# Altium project Wirless_Speaker.PrjPcb
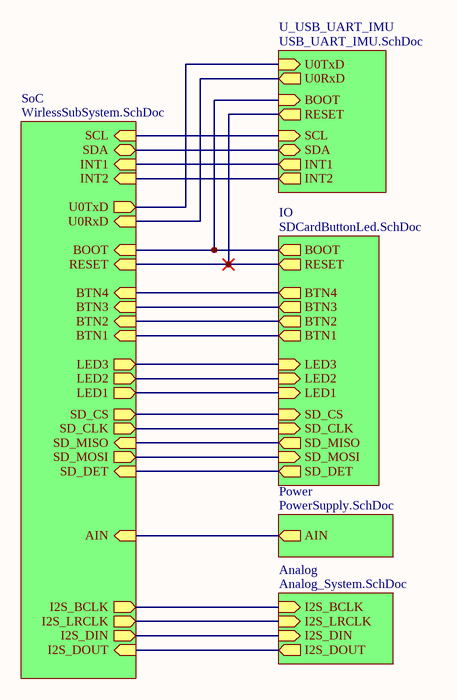
[diagram p0: WirlessSpeakerTop.SchDoc]
6 sheets, 94 parts. Net scope: hierarchical (ports join the sheet entries above them; power ports are global).
Board file: WirelessAudioSpeaker.PcbDoc
Sheets:
  WirlessSpeakerTop.SchDoc
    SoC = WirlessSubSystem.SchDoc
    IO = SDCardButtonLed.SchDoc
    Power = PowerSupply.SchDoc
    Analog = Analog_System.SchDoc
    U_USB_UART_IMU = USB_UART_IMU.SchDoc

## Sheet WirlessSpeakerTop.SchDoc
size A4; Date: 27.05.2014; Author: AOM1; DrawnBy: AOM1; Organization: BFH; Address1: Berner Fachhochschule; Address2: Technik und Informatik; Address3: Jlcoweg 1; Address4: 3400 Burgdorf; DocumentNumber: 1; Revision: 1.0; SheetNumber: 1; SheetTotal: 6; CurrentDate: 27.05.2014

### Sub-sheets
Analog = Analog_System.SchDoc: I2S_BCLK (in), I2S_LRCLK (in), I2S_DIN (in), I2S_DOUT (out)
IO = SDCardButtonLed.SchDoc: BOOT (out), RESET (out), BTN1 (out), BTN2 (out), BTN3 (out), BTN4 (out), LED1 (in), LED2 (in), LED3 (in), SD_CS (in), SD_CLK (in), SD_MISO (out), SD_MOSI (in), SD_DET (out)
Power = PowerSupply.SchDoc: AIN (out)
SoC = WirlessSubSystem.SchDoc: U0TxD (out), U0RxD (in), BOOT (in), RESET (in), SCL (in), SDA (bidir), INT1 (in), INT2 (in), BTN1 (in), BTN2 (in), BTN3 (in), BTN4 (in), LED1 (out), LED2 (out), LED3 (out), SD_CS (out), SD_CLK (out), SD_MISO (in), SD_MOSI (out), SD_DET (in), AIN (in), I2S_BCLK (out), I2S_LRCLK (out), I2S_DIN (out), I2S_DOUT (in)
U_USB_UART_IMU = USB_UART_IMU.SchDoc: U0RxD (out), U0TxD (in), BOOT (in), INT1 (out), INT2 (out), SCL (in), SDA (bidir), RESET (out)

### Nets
CLK: sheet SoC/SD_CLK, sheet IO/SD_CLK
CS: sheet SoC/SD_CS, sheet IO/SD_CS
I2S_BCLK: sheet SoC/I2S_BCLK, sheet Analog/I2S_BCLK
I2S_DIN: sheet SoC/I2S_DIN, sheet Analog/I2S_DIN
I2S_DOUT: sheet SoC/I2S_DOUT, sheet Analog/I2S_DOUT
I2S_LRCLK: sheet SoC/I2S_LRCLK, sheet Analog/I2S_LRCLK
MISO: sheet SoC/SD_MISO, sheet IO/SD_MISO
MOSI: sheet SoC/SD_MOSI, sheet IO/SD_MOSI
RXD: sheet SoC/U0TxD, sheet U_USB_UART_IMU/U0TxD
SCL: sheet SoC/SCL, sheet U_USB_UART_IMU/SCL
SDA: sheet SoC/SDA, sheet U_USB_UART_IMU/SDA
TXD: sheet SoC/U0RxD, sheet U_USB_UART_IMU/U0RxD
NetC200_2: sheet SoC/RESET, sheet IO/RESET, sheet U_USB_UART_IMU/RESET
NetQ100_3: sheet SoC/BOOT, sheet IO/BOOT, sheet U_USB_UART_IMU/BOOT
NetR106_1: sheet SoC/INT1, sheet U_USB_UART_IMU/INT1
NetR107_1: sheet SoC/INT2, sheet U_USB_UART_IMU/INT2
NetR200_1: sheet SoC/BTN1, sheet IO/BTN1
NetR201_1: sheet SoC/BTN2, sheet IO/BTN2
NetR202_1: sheet SoC/BTN3, sheet IO/BTN3
NetR203_1: sheet SoC/BTN4, sheet IO/BTN4
NetR204_2: sheet SoC/LED1, sheet IO/LED1
NetR205_2: sheet SoC/LED2, sheet IO/LED2
NetR206_2: sheet SoC/LED3, sheet IO/LED3
NetR208_1: sheet SoC/SD_DET, sheet IO/SD_DET
NetR503_1: sheet SoC/AIN, sheet Power/AIN

### Notes on the sheet
- Project Name:
- Title:
- Sheet Size:
- Sheet:
- of
- A4
- Drawn by:
- Time:
- Revision:
- Date:
- File Path:

## Sheet WirlessSubSystem.SchDoc
size A4; Date: 27.05.2014; Author: AOM1; DrawnBy: AOM1; Organization: BFH; Address1: Berner Fachhochschule; Address2: Technik und Informatik; Address3: Jlcoweg 1; Address4: 3400 Burgdorf; DocumentNumber: 1; Revision: 1.0; SheetNumber: 5; SheetTotal: 6; CurrentDate: 27.05.2014
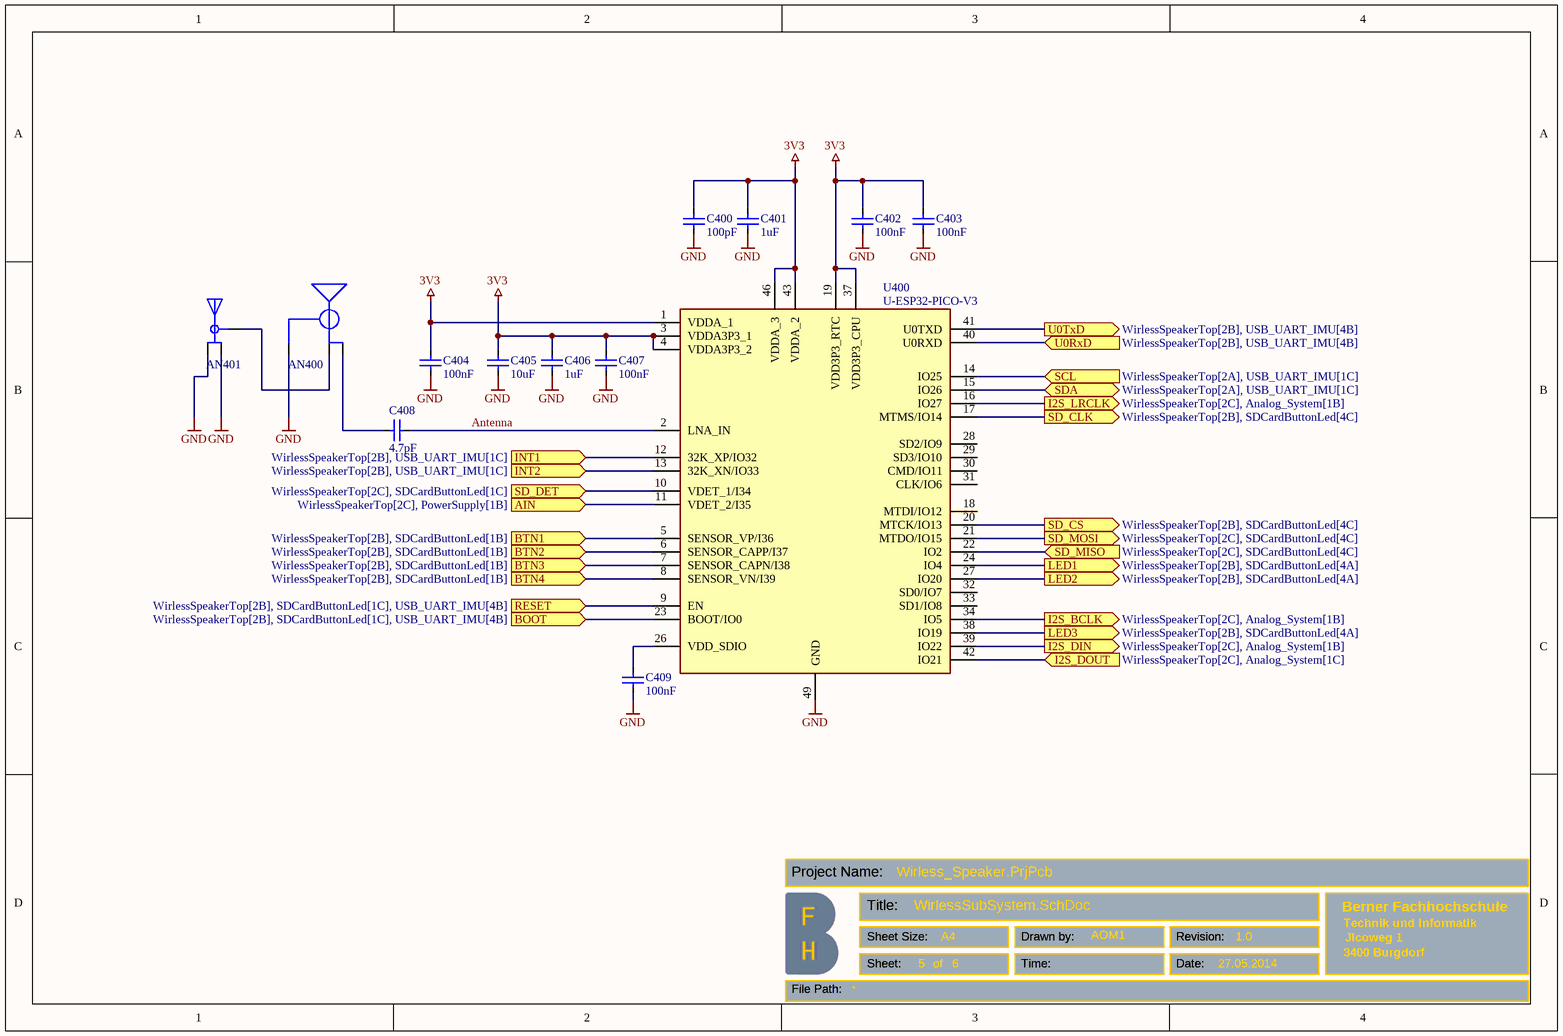
[diagram p1: WirlessSubSystem.SchDoc]

### Parts
AN400  PCB-Antenna  [ESP32-PCB-Antenna]  (value not drawn)
AN401  AN-U.FL-R-SMT-1(10)  [HRS_U.FL-R-SMT-1(10)]  (value not drawn)
C400  100pF  [C-0603]
C401  1uF  [C-0603]
C402  100nF  [C-0603]
C403  100nF  [C-0603]
C404  100nF  [C-0603]
C405  10uF  [C-0603]
C406  1uF  [C-0603]
C407  100nF  [C-0603]
C408  4.7pF  [C-0402]
C409  100nF  [C-0603]
U400  U-ESP32-PICO-V3  [ESP32PICOV3]

### Ports
AIN (in, see WirlessSpeakerTop[2C], PowerSupply[1B]), BOOT (in, see WirlessSpeakerTop[2B], SDCardButtonLed[1C], USB_UART_IMU[4B]), BTN1 (in, see WirlessSpeakerTop[2B], SDCardButtonLed[1B]), BTN2 (in, see WirlessSpeakerTop[2B], SDCardButtonLed[1B]), BTN3 (in, see WirlessSpeakerTop[2B], SDCardButtonLed[1B]), BTN4 (in, see WirlessSpeakerTop[2B], SDCardButtonLed[1B]), I2S_BCLK (out, see WirlessSpeakerTop[2C], Analog_System[1B]), I2S_DIN (out, see WirlessSpeakerTop[2C], Analog_System[1B]), I2S_DOUT (in, see WirlessSpeakerTop[2C], Analog_System[1C]), I2S_LRCLK (out, see WirlessSpeakerTop[2C], Analog_System[1B]), INT1 (in, see WirlessSpeakerTop[2B], USB_UART_IMU[1C]), INT2 (in, see WirlessSpeakerTop[2B], USB_UART_IMU[1C]), LED1 (out, see WirlessSpeakerTop[2B], SDCardButtonLed[4A]), LED2 (out, see WirlessSpeakerTop[2B], SDCardButtonLed[4A]), LED3 (out, see WirlessSpeakerTop[2B], SDCardButtonLed[4A]), RESET (in, see WirlessSpeakerTop[2B], SDCardButtonLed[1C], USB_UART_IMU[4B]), SCL (in, see WirlessSpeakerTop[2A], USB_UART_IMU[1C]), SD_CLK (out, see WirlessSpeakerTop[2B], SDCardButtonLed[4C]), SD_CS (out, see WirlessSpeakerTop[2B], SDCardButtonLed[4C]), SD_DET (in, see WirlessSpeakerTop[2C], SDCardButtonLed[1C]), SD_MISO (in, see WirlessSpeakerTop[2C], SDCardButtonLed[4C]), SD_MOSI (out, see WirlessSpeakerTop[2C], SDCardButtonLed[4C]), SDA (bidir, see WirlessSpeakerTop[2A], USB_UART_IMU[1C]), U0RxD (in, see WirlessSpeakerTop[2B], USB_UART_IMU[4B]), U0TxD (out, see WirlessSpeakerTop[2B], USB_UART_IMU[4B])

### Nets
3V3: C400.2 C401.2 C402.2 C403.2 C404.2 C405.2 C406.2 C407.2 U400.1(VDDA_1) U400.3(VDDA3P3_1) U400.4(VDDA3P3_2) U400.19(VDD3P3_RTC) U400.37(VDD3P3_CPU) U400.43(VDDA_2) U400.46(VDDA_3)
GND: AN400.GND AN401.1(GND) AN401.3(GND) C400.1 C401.1 C402.1 C403.1 C404.1 C405.1 C406.1 C407.1 C409.2 U400.49(GND)
Antenna: C408.1 U400.2(LNA_IN)
CLK: U400.17(MTMS/IO14) ; port SD_CLK
CS: U400.20(MTCK/IO13) ; port SD_CS
I2S_BCLK: U400.34(IO5) ; port I2S_BCLK
I2S_DIN: U400.39(IO22) ; port I2S_DIN
I2S_DOUT: U400.42(IO21) ; port I2S_DOUT
I2S_LRCLK: U400.16(IO27) ; port I2S_LRCLK
MISO: U400.22(IO2) ; port SD_MISO
MOSI: U400.21(MTDO/IO15) ; port SD_MOSI
RXD: U400.41(U0TXD) ; port U0TxD
SCL: U400.14(IO25) ; port SCL
SDA: U400.15(IO26) ; port SDA
TXD: U400.40(U0RXD) ; port U0RxD
NetAN400_ANT1: AN400.ANT1(ANT) C408.2
NetAN400_ANT2: AN400.ANT2(ANT) AN401.2(SIG)
NetC200_2: U400.9(EN) ; port RESET
NetC409_1: C409.1 U400.26(VDD_SDIO)
NetQ100_3: U400.23(BOOT/IO0) ; port BOOT
NetR106_1: U400.12(32K_XP/IO32) ; port INT1
NetR107_1: U400.13(32K_XN/IO33) ; port INT2
NetR200_1: U400.5(SENSOR_VP/I36) ; port BTN1
NetR201_1: U400.6(SENSOR_CAPP/I37) ; port BTN2
NetR202_1: U400.7(SENSOR_CAPN/I38) ; port BTN3
NetR203_1: U400.8(SENSOR_VN/I39) ; port BTN4
NetR204_2: U400.24(IO4) ; port LED1
NetR205_2: U400.27(IO20) ; port LED2
NetR206_2: U400.38(IO19) ; port LED3
NetR208_1: U400.10(VDET_1/I34) ; port SD_DET
NetR503_1: U400.11(VDET_2/I35) ; port AIN

Not connected (* = marked no-connect by the designer): U400 18(MTDI/IO12) 28(SD2/IO9) 29(SD3/IO10) 30(CMD/IO11) 31(CLK/IO6) 32(SD0/IO7) 33(SD1/IO8)

### Notes on the sheet
- Project Name:
- Title:
- Sheet Size:
- Sheet:
- of
- A4
- Drawn by:
- Time:
- Revision:
- Date:
- File Path:

### Library data of the parts
AN400 = AN-ESP32-PCB-Antenna: PCB, 2.4 GHz Antenna; Manufacturer: BFH; Part-Number: PCB 2.4 GHz Antenna; Added: 28.08.2018; Price (CHF): 0.0; ComponentLink1Description: Antenna for ESP32; Order_Code: PCB 2.4 GHz Antenna
AN401 = AN-U.FL-R-SMT-1(10): U.FL _UMCC_ Connector Receptacle, Male Pin 50Ohm Surface Mount Solder; Manufacturer: Hirose; Order-Code: 798-U.FL-R-SMT-110; Mfr. Part No.: U.FL-R-SMT-1(10); SnapEDA_Link: https://www.snapeda.com/parts/U.FL-R-SMT-1%2810%29/Hirose%20Electric%20Co%20Ltd/view-part/55192/?ref=snap; Distributor: Mouser; Package: None; Value: *; Notice: *
C400-C407 C409 = C-SMD-0603: Multilayer Ceramic Capacitors MLCC; Manufacturer: Murata Electronics; Mfr. Part No.: GRM18...; Order-Code: 81-GRM18...; Price (CHF): 0.12; Distributor: Mouser; Added: 28.08.2018; ComponentLink1Description: Chip Multilayer Ceramic Capacitors; ComponentLink1URL: https://www.mouser.ch/datasheet/2/281/murata_03052018_GRM_Series_1-1310166.pdf; Notice: -; Mounting Style: SMD/SMT; Package: 0603
C408 = C-SMD-0402: Multilayer Ceramic Capacitors MLCC; Manufacturer: Murata Electronics; Mfr. Part No.: GRM02*; Order-Code: 81-GRM02...; Price (CHF): 0.12; Distributor: Mouser; Added: 28.08.2018; ComponentLink1Description: Chip Multilayer Ceramic Capacitors; ComponentLink1URL: https://www.mouser.ch/datasheet/2/281/murata_03052018_GRM_Series_1-1310166.pdf; Notice: -; Mounting Style: SMD/SMT; Package: 0402
U400 = U-ESP32-PICO-V3-BFH: RF System on a Chip; Manufacturer_Name: Espressif Systems; Manufacturer: Espressif; Mfr. Part No.: ESP32-PICO-V3-02; Mountig Style: SMD/SMT; Order-Code: 356-ESP32-PICO-V3-02; Datasheet Link: https://kr.mouser.com/datasheet/2/891/esp32-pico-v3_datasheet_en-1842685.pdf; Height: 1.04mm; Manufacturer_Part_Number: ESP32-PICO-V3; Mouser Part Number: 356-ESP32-PICO-V3; Mouser Price/Stock: https://www.mouser.co.uk/ProductDetail/Espressif-Systems/ESP32-PICO-V3?qs=GBLSl2Akirs311o8knsnZA%3D%3D; Added: 08.08.2021; Distributor: Mouser; Package: ESP32PICOV3; Notice: -; Price (CHF): 3.20

## Sheet SDCardButtonLed.SchDoc
size A4; Date: 27.05.2014; Author: AOM1; DrawnBy: AOM1; Organization: BFH; Address1: Berner Fachhochschule; Address2: Technik und Informatik; Address3: Jlcoweg 1; Address4: 3400 Burgdorf; DocumentNumber: 1; Revision: 1.0; SheetNumber: 3; SheetTotal: 6; CurrentDate: 27.05.2014
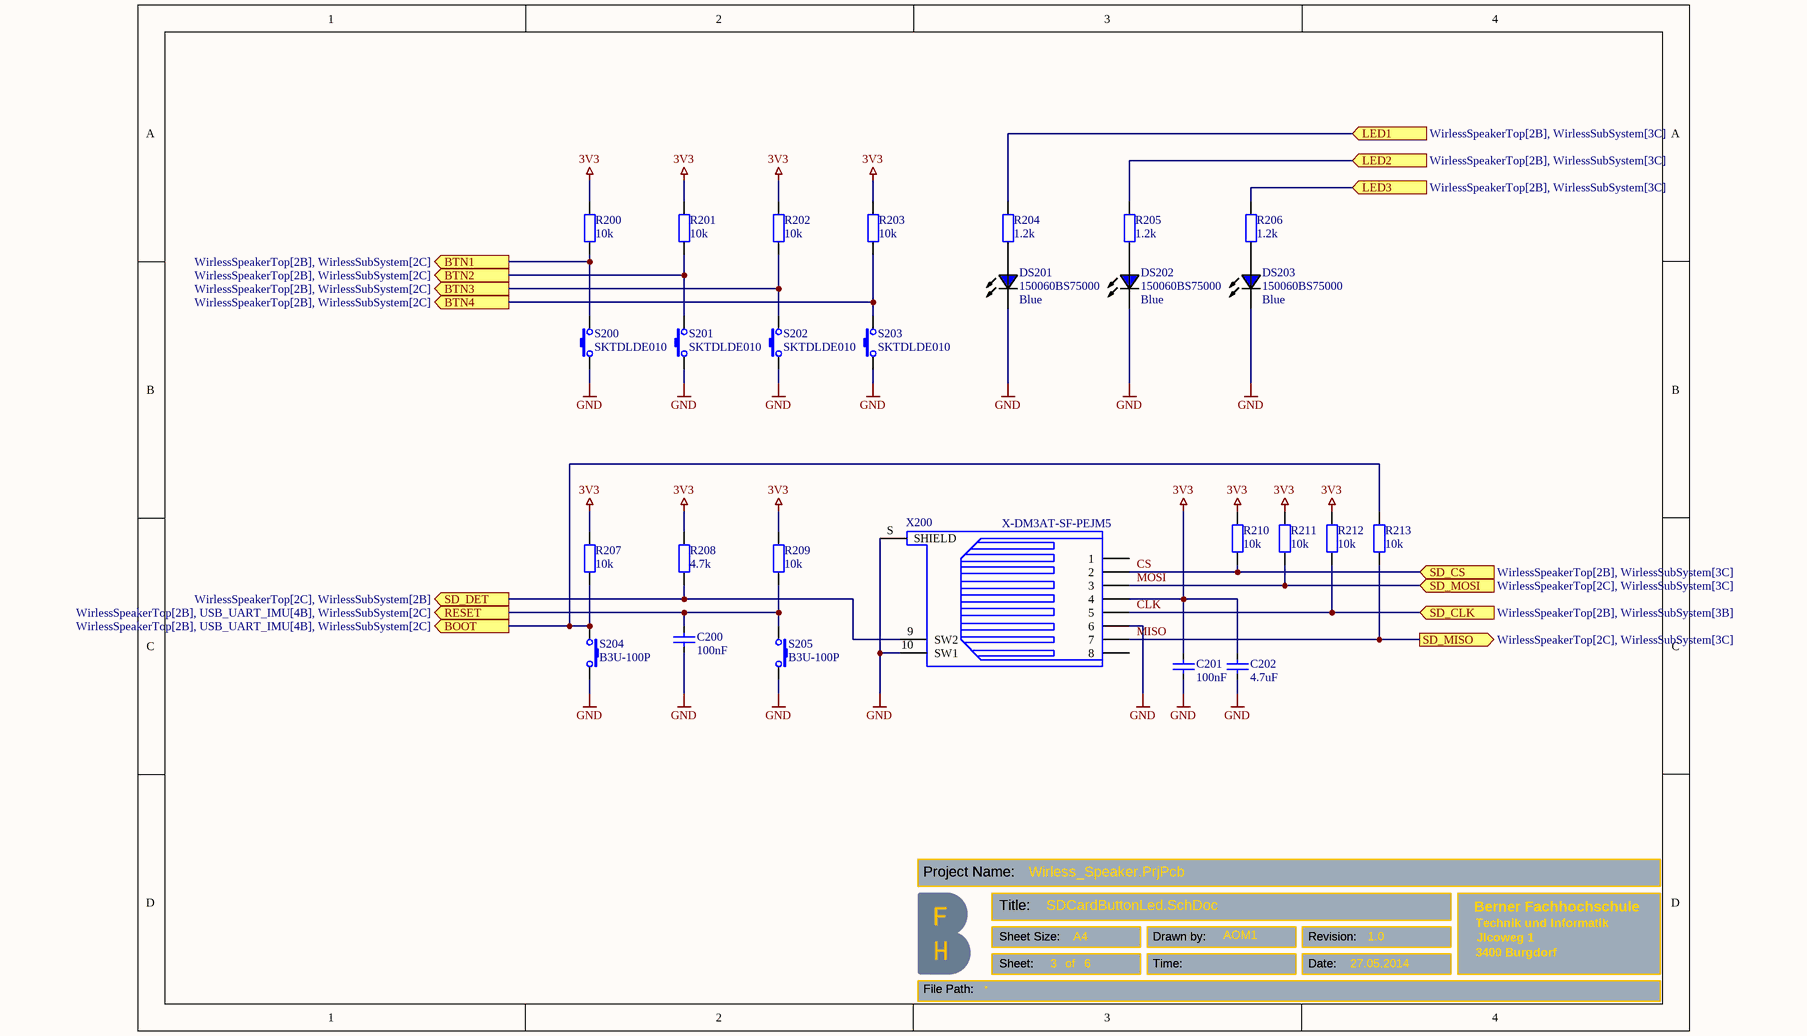
[diagram p2: SDCardButtonLed.SchDoc]

### Parts
C200  100nF  [C-0603]
C201  100nF  [C-0603]
C202  4.7uF  [C-0603]
DS201  150060BS75000  value Blue  [LED-0603-BLUE]
DS202  150060BS75000  value Blue  [LED-0603-BLUE]
DS203  150060BS75000  value Blue  [LED-0603-BLUE]
R200  10k  [R-0603]
R201  10k  [R-0603]
R202  10k  [R-0603]
R203  10k  [R-0603]
R204  1.2k  [R-0603]
R205  1.2k  [R-0603]
R206  1.2k  [R-0603]
R207  10k  [R-0603]
R208  4.7k  [R-0603]
R209  10k  [R-0603]
R210  10k  [R-0603]
R211  10k  [R-0603]
R212  10k  [R-0603]
R213  10k  [R-0603]
S200  SKTDLDE010  [S-SKTDLDE010]
S201  SKTDLDE010  [S-SKTDLDE010]
S202  SKTDLDE010  [S-SKTDLDE010]
S203  SKTDLDE010  [S-SKTDLDE010]
S204  B3U-100P  [S-B3U-100X]
S205  B3U-100P  [S-B3U-100X]
X200  X-DM3AT-SF-PEJM5  [X-DM3AT-SF-PEJM5]

### Ports
BOOT (out, see WirlessSpeakerTop[2B], USB_UART_IMU[4B], WirlessSubSystem[2C]), BTN1 (out, see WirlessSpeakerTop[2B], WirlessSubSystem[2C]), BTN2 (out, see WirlessSpeakerTop[2B], WirlessSubSystem[2C]), BTN3 (out, see WirlessSpeakerTop[2B], WirlessSubSystem[2C]), BTN4 (out, see WirlessSpeakerTop[2B], WirlessSubSystem[2C]), LED1 (in, see WirlessSpeakerTop[2B], WirlessSubSystem[3C]), LED2 (in, see WirlessSpeakerTop[2B], WirlessSubSystem[3C]), LED3 (in, see WirlessSpeakerTop[2B], WirlessSubSystem[3C]), RESET (out, see WirlessSpeakerTop[2B], USB_UART_IMU[4B], WirlessSubSystem[2C]), SD_CLK (in, see WirlessSpeakerTop[2B], WirlessSubSystem[3B]), SD_CS (in, see WirlessSpeakerTop[2B], WirlessSubSystem[3C]), SD_DET (out, see WirlessSpeakerTop[2C], WirlessSubSystem[2B]), SD_MISO (out, see WirlessSpeakerTop[2C], WirlessSubSystem[3C]), SD_MOSI (in, see WirlessSpeakerTop[2C], WirlessSubSystem[3C])

### Nets
3V3: C201.2 C202.2 R200.2 R201.2 R202.2 R203.2 R207.2 R208.2 R209.2 R210.2 R211.2 R212.2 X200.4
GND: C200.1 C201.1 C202.1 DS201.K DS202.K DS203.K S200.1 S201.1 S202.1 S203.1 S204.2 S205.2 X200.6 X200.10(SW1) X200.S(SHIELD)
CLK: R212.1 X200.5 ; port SD_CLK
CS: R210.1 X200.2 ; port SD_CS
MISO: R213.1 X200.7 ; port SD_MISO
MOSI: R211.1 X200.3 ; port SD_MOSI
NetC200_2: C200.2 R209.1 S205.1 ; port RESET
NetDS201_A: DS201.A R204.1
NetDS202_A: DS202.A R205.1
NetDS203_A: DS203.A R206.1
NetQ100_3: R207.1 R213.2 S204.1 ; port BOOT
NetR200_1: R200.1 S200.2 ; port BTN1
NetR201_1: R201.1 S201.2 ; port BTN2
NetR202_1: R202.1 S202.2 ; port BTN3
NetR203_1: R203.1 S203.2 ; port BTN4
NetR204_2: R204.2 ; port LED1
NetR205_2: R205.2 ; port LED2
NetR206_2: R206.2 ; port LED3
NetR208_1: R208.1 X200.9(SW2) ; port SD_DET

Not connected (* = marked no-connect by the designer): X200 1 8

### Notes on the sheet
- Project Name:
- Title:
- Sheet Size:
- Sheet:
- of
- A4
- Drawn by:
- Time:
- Revision:
- Date:
- File Path:

### Library data of the parts
C200-C202 = C-SMD-0603: as C400 on sheet WirlessSubSystem; Price (CHF): 0.12; Distributor: Mouser; Added: 28.08.2018; ComponentLink1Description: Chip Multilayer Ceramic Capacitors; ComponentLink1URL: https://www.mouser.ch/datasheet/2/281/murata_03052018_GRM_Series_1-1310166.pdf; Notice: -; Mounting Style: SMD/SMT; Package: 0603
DS201-DS203 = DS-LED-BLUE: Standard LEDs - SMD 0603 Blue; Manufacturer: Wurth Elektronik; Order-Code: 710-150060BS75000; Distributor: Mouser; Price (CHF): 0.105; Added: 06.08.2021; Package: 0603; Mounting Style: SMD/SMT; Notice: -; Mfr. Part No.: 150060BS75000
R200-R213 = R-SMD-0603: Thin Film Resistors - SMD  0.1W  1%; Mfr. Part No.: MCU08050C*; Manufacturer: Vishay / Beyschlag; Order-Code: BFH-Lager; Price (CHF): 0.1; Distributor: Mouser; Notice: -; Added: 10.11.2012; Mounting Style: SMD/SMT; Package: 0603
S200-S203 = S-Tactile-Switch: Tactile Switches 6x6 Flat 4.3mm Btn Force 100g w/o Grd; Manufacturer: ALPS; Order-Code: 688-SKTDLDE010; Distributor: Mouser; Price (CHF): 0.43; Added: 28.08.2018; ComponentLink1Description: Tactile Switch; ComponentLink1URL: http://www.farnell.com/datasheets/2082873.pdf?_ga=2.143512053.1712594784.1535524557-997716388.1524486210; Mfr. Part No.: SKTDLDE010; Notice: -; Package: LxWxH 3.9x2.9x1.55mm; Mounting Style: SMD/SMT
S204 S205 = S-B3U-100P: Tactile Switches Top Actuated w/o boss w/o ground; Manufacturer: OMRON ELECTRONIC COMPONENTS; Mfr. Part No.: B3U-1000P; Order-Code: 653-B3U-1000P; Price (CHF): 0.772; Added: 28.08.2018; Distributor: Mouser; ComponentLink1Description: Ultra-small Tactile Switch (SMT); ComponentLink1URL: http://www.farnell.com/datasheets/2610940.pdf?_ga=2.224737754.1712594784.1535524557-997716388.1524486210; Notice: -; Package: 2.5x3mm; Mounting Style: SMD/SMT
X200 = X-DM3AT-SF-PEJM5: SMTMicro SD 8 Pin PCB; Manufacturer: Hirose Electric Co Ltd; Order-Code: 798-DM3AT-SF-PEJM5; Distributor: Mouser; Price (CHF): 1.8; Mfr. Part No.: DM3AT-SF-PEJM5; Added: 08.08.2021; Package: DM3AT-SF-PEJM5; Notice: -; Mounting Style: SMD/SMT

## Sheet PowerSupply.SchDoc
size A4; Date: 27.05.2014; Author: REUSN5; DrawnBy: REUSN5; Organization: BFH; Address1: Berner Fachhochschule; Address2: Technik und Informatik; Address3: Jlcoweg 1; Address4: 3400 Burgdorf; DocumentNumber: 1; Revision: 1.0; SheetNumber: 6; SheetTotal: 6; CurrentDate: 27.05.2014
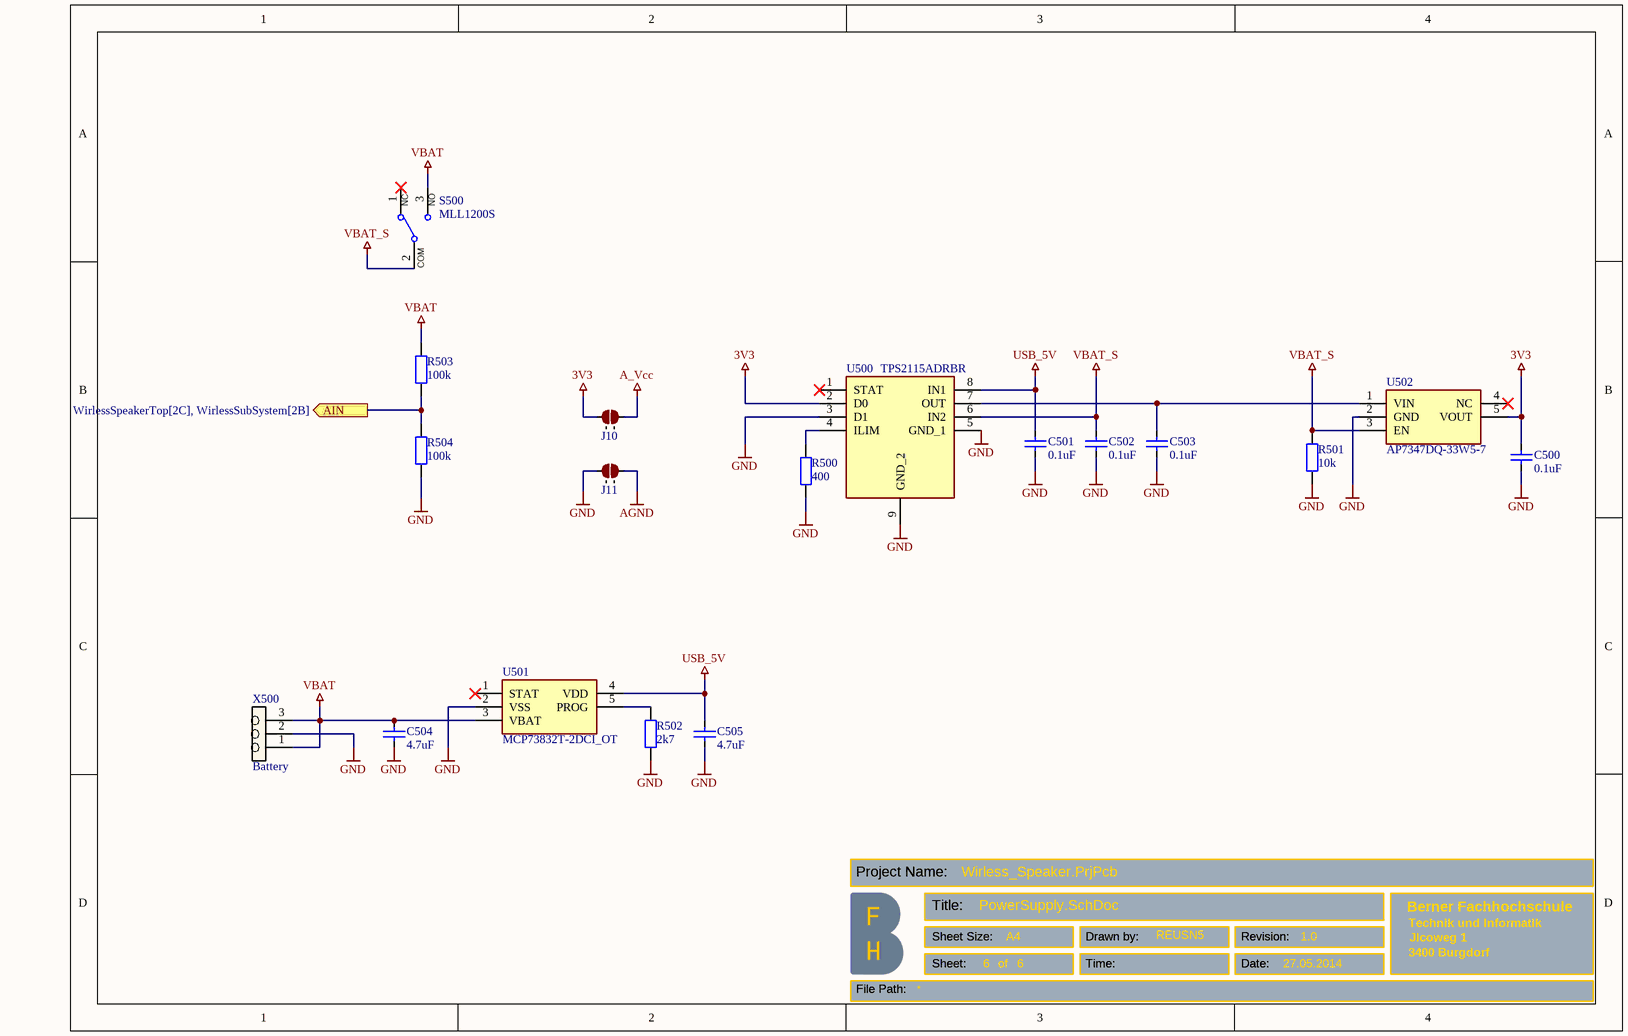
[diagram p3: PowerSupply.SchDoc]

### Parts
C500  0.1uF  [C-0603]
C501  0.1uF  [C-0603]
C502  0.1uF  [C-0603]
C503  0.1uF  [C-0603]
C504  4.7uF  [C-0603]
C505  4.7uF  [C-0603]
J10  2 way net solder junction - Normally Open  [2waySolder_NO]  (value not drawn)  (no BOM)
J11  2 way net solder junction - Normally Open  [2waySolder_NO]  (value not drawn)  (no BOM)
R500  400  [R-0603]
R501  10k  [R-0603]
R502  2k7  [R-0603]
R503  100k  [R-0603]
R504  100k  [R-0603]
S500  MLL1200S  [S-MLL1200S]
U500  TPS2115ADRBR  [SON65P300X300X100-9N-D]
U501  MCP73832T-2DCI_OT  [SOT-23-5]
U502  AP7347DQ-33W5-7  [SOT95P280X145-5N]
X500  Battery  [Battery]

### Ports
AIN (out, see WirlessSpeakerTop[2C], WirlessSubSystem[2B])

### Nets
3V3: C500.2 J10.1 U500.2(D0) U502.5(VOUT)
A_Vcc: J10.2
AGND: J11.2
GND: C500.1 C501.1 C502.1 C503.1 C504.1 C505.1 J11.1 R500.1 R501.1 R502.1 R504.1 U500.3(D1) U500.5(GND_1) U500.9(GND_2) U501.2(VSS) U502.2(GND) X500.2
USB_5V: C501.2 C505.2 U500.8(IN1) U501.4(VDD)
VBAT: C504.2 R503.2 S500.3(NO) U501.3(VBAT) X500.1 X500.3
VBAT_S: C502.2 R501.2 S500.2(Common) U500.6(IN2) U502.3(EN)
NetC503_2: C503.2 U500.7(OUT) U502.1(VIN)
NetR500_2: R500.2 U500.4(ILIM)
NetR502_2: R502.2 U501.5(PROG)
NetR503_1: R503.1 R504.2 ; port AIN

Not connected (* = marked no-connect by the designer): S500 1(NC)*; U500 1(STAT)*; U501 1(STAT)*; U502 4(NC)*

### Notes on the sheet
- Project Name:
- Title:
- Sheet Size:
- Sheet:
- of
- A4
- Drawn by:
- Time:
- Revision:
- Date:
- File Path:
- (in symbol S-Slide-Switch) COM

### Library data of the parts
C500-C505 = C-SMD-0603: as C400 on sheet WirlessSubSystem; Price (CHF): 0.12; Distributor: Mouser; Added: 28.08.2018; ComponentLink1Description: Chip Multilayer Ceramic Capacitors; ComponentLink1URL: https://www.mouser.ch/datasheet/2/281/murata_03052018_GRM_Series_1-1310166.pdf; Notice: -; Mounting Style: SMD/SMT; Package: 0603
J10 J11 = 2waySolderNO: ComponentLink1URL: http://www.edatools.cz/addons; ComponentLink1Description: Source
R500-R504 = R-SMD-0603: as R200 on sheet SDCardButtonLed; Price (CHF): 0.1; Distributor: Mouser; Notice: -; Added: 10.11.2012; Mounting Style: SMD/SMT; Package: 0603
S500 = S-Slide-Switch: Slide Switch SPDT RA SMT MLL1200S; Manufacturer: TE Connectivity; Order-Code: 506-MLL1200S; Distributor: Mouser; Price (CHF): 2.27; Added: 08.10.2018; Notice: -; Mounting Style: SMD/SMT; Package: SMD/SMT; Datasheet Link: https://www.te.com/commerce/DocumentDelivery/DDEController?Action=srchrtrv&DocNm=1437575-1&DocType=Customer+Drawing&DocLang=English&DocFormat=pdf&PartCntxt=1437575-1; Mfr. Part. Nr.: MLL1200S
U500 = TPS2115ADRBR: Power Supply; Manufacturer_Name: Texas Instruments; Datasheet Link: http://www.ti.com/lit/gpn/tps2115a; Height: 1mm; Manufacturer_Part_Number: TPS2115ADRBR; Mouser Part Number: 595-TPS2115ADRBR; Mouser Price/Stock: https://www.mouser.co.uk/ProductDetail/Texas-Instruments/TPS2115ADRBR?qs=g%2FrhRe7LVpSXEuLZV5FMOQ%3D%3D; Arrow Part Number: TPS2115ADRBR; Arrow Price/Stock: https://www.arrow.com/en/products/tps2115adrbr/texas-instruments?region=nac
U501 = MCP73832T-2DCI_OT: Integrated Circuit; Manufacturer_Name: Microchip; Manufacturer_Part_Number: MCP73832T-2DCI/OT; Datasheet Link: http://ww1.microchip.com/downloads/en/DeviceDoc/20001984g.pdf; Height: 1.45mm; Mouser Part Number: 579-MCP73832T-2DCIOT; Mouser Price/Stock: https://www.mouser.co.uk/ProductDetail/Microchip-Technology/MCP73832T-2DCI-OT?qs=yUQqVecv4quyMtCX903Btw%3D%3D; Arrow Part Number: MCP73832T-2DCI/OT; Arrow Price/Stock: https://www.arrow.com/en/products/mcp73832t-2dciot/microchip-technology?region=nac
U502 = AP7347DQ-33W5-7: Integrated Circuit; Manufacturer_Name: Diodes Inc.; Datasheet Link: https://ad.componentsearchengine.com/partRequest.html?fs=0&partNumber=AP7347DQ-33W5-7&partID=15420390&lang=null&packageCategoryID=54&C=1&W=1; Height: 1.45mm; Manufacturer_Part_Number: AP7347DQ-33W5-7; Mouser Part Number: 621-AP7347DQ-33W5-7; Mouser Price/Stock: https://www.mouser.co.uk/ProductDetail/Diodes-Incorporated/AP7347DQ-33W5-7?qs=XAiT9M5g4x%252B4DeOtxqD2uw%3D%3D; Arrow Part Number: AP7347DQ-33W5-7; Arrow Price/Stock: https://www.arrow.com/en/products/ap7347dq-33w5-7/diodes-incorporated?region=nac
X500 = X-Battery: Battery  connection pads; Value: Battery; Price (CHF): -; Order-Code: -; Manufacturer: -; Provider: -; Mfr. Part No.: -; Added: 10.08.2021; Mounting Style: Through Hole; Notice: -; Package: -

## Sheet Analog_System.SchDoc
size A4; Date: 27.05.2014; Author: AOM1; DrawnBy: AOM1; Organization: BFH; Address1: Berner Fachhochschule; Address2: Technik und Informatik; Address3: Jlcoweg 1; Address4: 3400 Burgdorf; DocumentNumber: 1; Revision: 1.0; SheetNumber: 4; SheetTotal: 6; CurrentDate: 27.05.2014
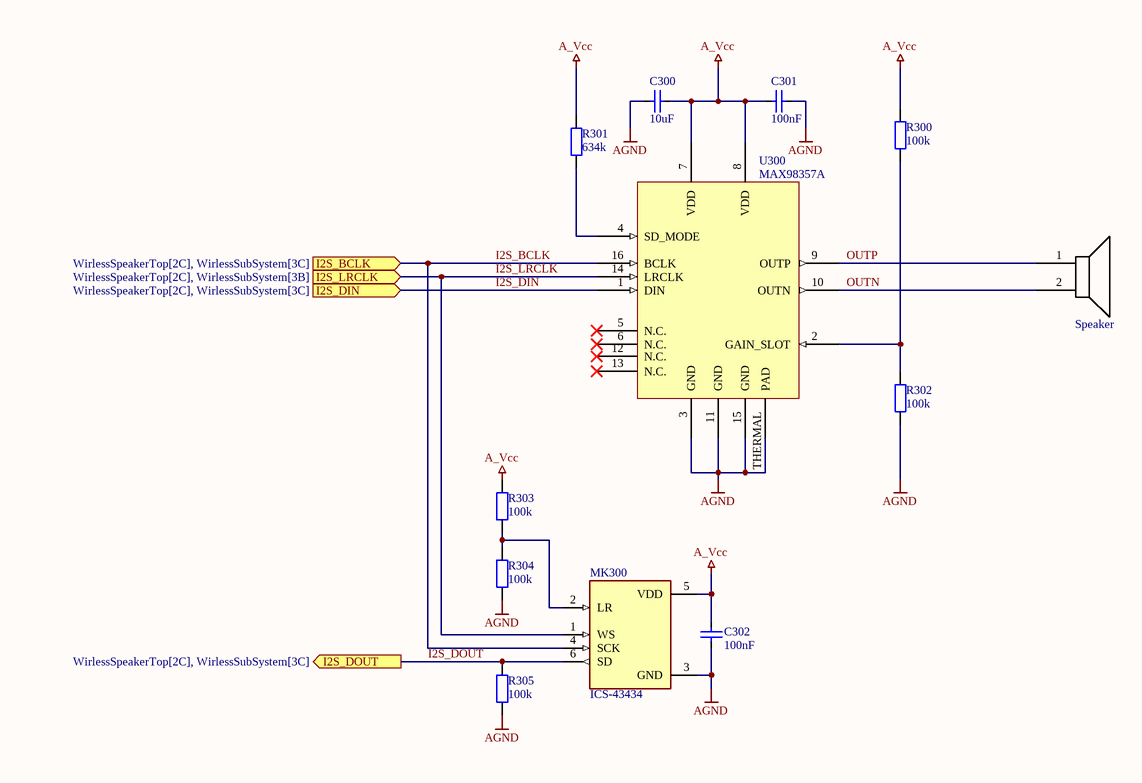
[diagram p4: Analog_System.SchDoc]

### Parts
C300  10uF  [C-0603]
C301  100nF  [C-0603]
C302  100nF  [C-0603]
MK300  ICS-43434  [MK-ICS-43434]
R300  100k  [R-0603]
R301  634k  [R-0603]
R302  100k  [R-0603]
R303  100k  [R-0603]
R304  100k  [R-0603]
R305  100k  [R-0603]
Speaker  Speaker  [A-Speaker-Connector]  (value not drawn)
U300  MAX98357A  [QFN16-3MM]

### Ports
I2S_BCLK (in, see WirlessSpeakerTop[2C], WirlessSubSystem[3C]), I2S_DIN (in, see WirlessSpeakerTop[2C], WirlessSubSystem[3C]), I2S_DOUT (out, see WirlessSpeakerTop[2C], WirlessSubSystem[3C]), I2S_LRCLK (in, see WirlessSpeakerTop[2C], WirlessSubSystem[3B])

### Nets
A_Vcc: C300.2 C301.1 C302.2 MK300.5(VDD) R300.2 R301.2 R303.2 U300.7(VDD) U300.8(VDD)
AGND: C300.1 C301.2 C302.1 MK300.3(GND) R302.1 R304.1 R305.1 U300.3(GND) U300.11(GND) U300.15(GND) U300.THERMAL(PAD)
I2S_BCLK: MK300.4(SCK) U300.16(BCLK) ; port I2S_BCLK
I2S_DIN: U300.1(DIN) ; port I2S_DIN
I2S_DOUT: MK300.6(SD) R305.2 ; port I2S_DOUT
I2S_LRCLK: MK300.1(WS) U300.14(LRCLK) ; port I2S_LRCLK
OUTN: Speaker.2 U300.10(OUTN)
OUTP: Speaker.1 U300.9(OUTP)
NetMK300_2: MK300.2(LR) R303.1 R304.2
NetR300_1: R300.1 R302.2 U300.2(GAIN_SLOT)
NetR301_1: R301.1 U300.4(SD_MODE)

Not connected (* = marked no-connect by the designer): U300 5(N.C.)* 6(N.C.)* 12(N.C.)* 13(N.C.)*

### Notes on the sheet
- Project Name:
- Title:
- Sheet Size:
- Sheet:
- of
- A4
- Drawn by:
- Time:
- Revision:
- Date:
- File Path:

### Library data of the parts
C300-C302 = C-SMD-0603: as C400 on sheet WirlessSubSystem; Price (CHF): 0.12; Distributor: Mouser; Added: 28.08.2018; ComponentLink1Description: Chip Multilayer Ceramic Capacitors; ComponentLink1URL: https://www.mouser.ch/datasheet/2/281/murata_03052018_GRM_Series_1-1310166.pdf; Notice: -; Mounting Style: SMD/SMT; Package: 0603
MK300 = MK-ICS-43434: Microphone MEMS / 60Hz ~ 20kHz Digital, I²S; Manufacturer: TDK InvenSense; Pckage: SMD/SMT; Order-Code: 410-ICS-43434; Added: 16.09.2020; Distributor: Mouser; Price (CHF): 2.64; Mfr. Part No.: ICS-43434; Mounting Style: SMD/SMT; Notice: -
R300-R305 = R-SMD-0603: as R200 on sheet SDCardButtonLed; Price (CHF): 0.1; Distributor: Mouser; Notice: -; Added: 10.11.2012; Mounting Style: SMD/SMT; Package: 0603
Speaker = A_Speaker: Speaker, 3W 8 Ohm; Manufacturer: *; Provider: *; Order_Number: *; Price: *; Value: *
U300 = U-MAX98357A: Tiny, Low-Cost, PCM Class D Amplifier; Manufacturer: Maxim Integrated; Part-Number: MAX98357AETE+T; Order-Code: 700-MAX98357AETE+T; Added: 28.08.2018; Distributor: Mouser; Price (CHF): 2.03; ComponentLink1Description: Low-Cost, PCM Class D Amplifier; ComponentLink1URL: https://www.mouser.ch/datasheet/2/256/MAX98357A-MAX98357B-271244.pdf; Notice: -; Package: QFN16; Mounting Style: SMD/SMT; Mfr. Part No.: MAX98357AETE+T

## Sheet USB_UART_IMU.SchDoc
size A4; Date: 27.05.2014; Author: AOM1; DrawnBy: AOM1; Organization: BFH; Address1: Berner Fachhochschule; Address2: Technik und Informatik; Address3: Jlcoweg 1; Address4: 3400 Burgdorf; DocumentNumber: 1; Revision: 1.0; SheetNumber: 2; SheetTotal: 6; CurrentDate: 27.05.2014
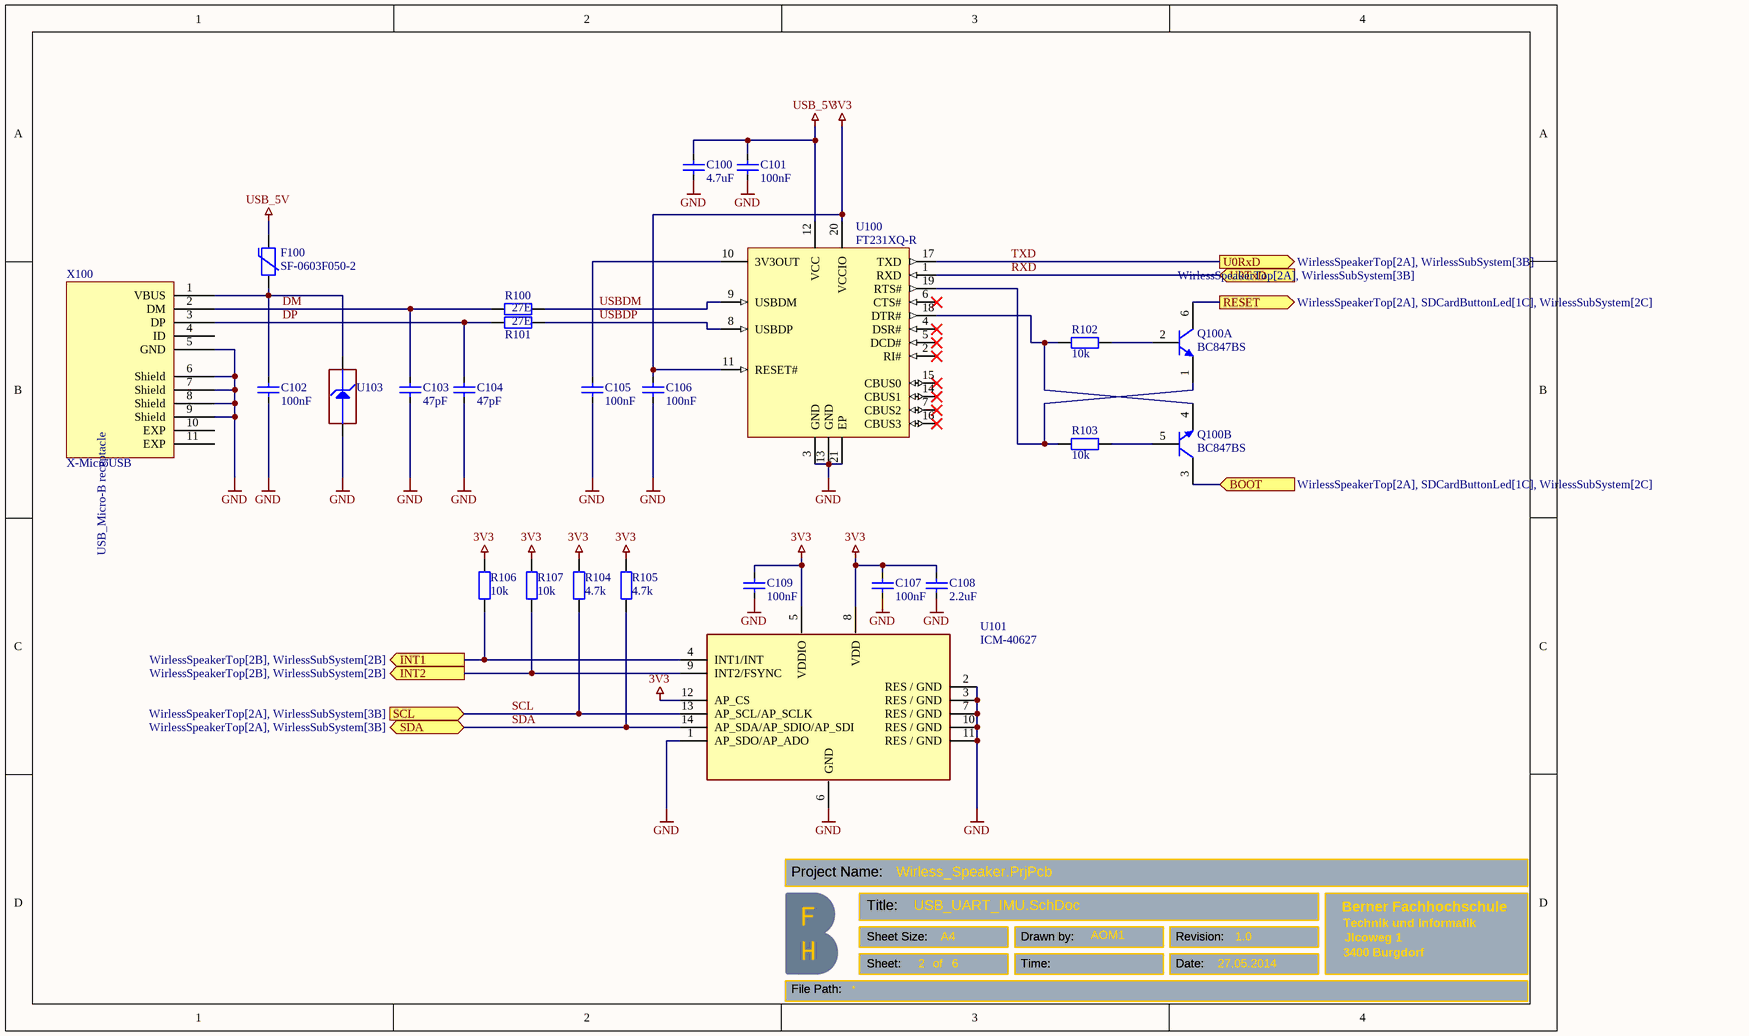
[diagram p5: USB_UART_IMU.SchDoc]

### Parts
C100  4.7uF  [C-0603]
C101  100nF  [C-0603]
C102  100nF  [C-0603]
C103  47pF  [C-0603]
C104  47pF  [C-0603]
C105  100nF  [C-0603]
C106  100nF  [C-0603]
C107  100nF  [C-0603]
C108  2.2uF  [C-0603]
C109  100nF  [C-0603]
F100  SF-0603F050-2  [SMD-0603]
Q100  BC847BS  [SOT-23-6]  (parts A,B of 2)
R100  27E  [R-0603]
R101  27E  [R-0603]
R102  10k  [R-0603]
R103  10k  [R-0603]
R104  4.7k  [R-0603]
R105  4.7k  [R-0603]
R106  10k  [R-0603]
R107  10k  [R-0603]
U100  FT231XQ-R  [QFN-20-M]
U101  ICM-40627  [LGA-14]
U103  ESDA7P120-1U1M  [ESD_QFN1610_2N_1K_2A]  (value not drawn)
X100  X-MicroUSB  [Micro-USB]

### Ports
BOOT (in, see WirlessSpeakerTop[2A], SDCardButtonLed[1C], WirlessSubSystem[2C]), INT1 (out, see WirlessSpeakerTop[2B], WirlessSubSystem[2B]), INT2 (out, see WirlessSpeakerTop[2B], WirlessSubSystem[2B]), RESET (out, see WirlessSpeakerTop[2A], SDCardButtonLed[1C], WirlessSubSystem[2C]), SCL (in, see WirlessSpeakerTop[2A], WirlessSubSystem[3B]), SDA (bidir, see WirlessSpeakerTop[2A], WirlessSubSystem[3B]), U0RxD (out, see WirlessSpeakerTop[2A], WirlessSubSystem[3B]), U0TxD (in, see WirlessSpeakerTop[2A], WirlessSubSystem[3B])

### Nets
3V3: C106.2 C107.2 C108.2 C109.2 R104.2 R105.2 R106.2 R107.2 U100.11(RESET#) U100.20(VCCIO) U101.5(VDDIO) U101.8(VDD) U101.12(AP_CS)
GND: C100.1 C101.1 C102.1 C103.1 C104.1 C105.1 C106.1 C107.1 C108.1 C109.1 U100.3(GND) U100.13(GND) U100.21(EP) U101.1(AP_SDO/AP_ADO) U101.2(RES_/_GND) U101.3(RES_/_GND) U101.6(GND) U101.7(RES_/_GND) U101.10(RES_/_GND) U101.11(RES_/_GND) U103.2(GND) X100.5(GND) X100.6(Shield) X100.7(Shield) X100.8(Shield) X100.9(Shield)
USB_5V: C100.2 C101.2 F100.2 U100.12(VCC)
DM: C103.2 R100.1 X100.2(DM)
DP: C104.2 R101.1 X100.3(DP)
RXD: U100.1(RXD) ; port U0TxD
SCL: R104.1 U101.13(AP_SCL/AP_SCLK) ; port SCL
SDA: R105.1 U101.14(AP_SDA/AP_SDIO/AP_SDI) ; port SDA
TXD: U100.17(TXD) ; port U0RxD
USBDM: R100.2 U100.9(USBDM)
USBDP: R101.2 U100.8(USBDP)
NetC102_2: C102.2 F100.1 U103.1(IO1) X100.1(VBUS)
NetC105_2: C105.2 U100.10(3V3OUT)
NetC200_2: Q100.6(C1) ; port RESET
NetQ100_1: Q100.1(E1) R103.1 U100.19(RTS#)
NetQ100_2: Q100.2(B1) R102.2
NetQ100_3: Q100.3(C2) ; port BOOT
NetQ100_4: Q100.4(E2) R102.1 U100.18(DTR#)
NetQ100_5: Q100.5(B2) R103.2
NetR106_1: R106.1 U101.4(INT1/INT) ; port INT1
NetR107_1: R107.1 U101.9(INT2/FSYNC) ; port INT2

Not connected (* = marked no-connect by the designer): U100 2(RI#)* 4(DSR#)* 5(DCD#)* 6(CTS#)* 7(CBUS2)* 14(CBUS1)* 15(CBUS0)* 16(CBUS3)*; X100 4(ID) 10(EXP) 11(EXP)

### Notes on the sheet
- Project Name:
- Title:
- Sheet Size:
- Sheet:
- of
- A4
- Drawn by:
- Time:
- Revision:
- Date:
- File Path:
- (in symbol X-MicroUSB) USB_Micro-B receptacle

### Library data of the parts
C100-C109 = C-SMD-0603: as C400 on sheet WirlessSubSystem; Price (CHF): 0.12; Distributor: Mouser; Added: 28.08.2018; ComponentLink1Description: Chip Multilayer Ceramic Capacitors; ComponentLink1URL: https://www.mouser.ch/datasheet/2/281/murata_03052018_GRM_Series_1-1310166.pdf; Notice: -; Mounting Style: SMD/SMT; Package: 0603
F100 = F-0603F050-2: Surface Mount Fuses 0.5A Fast Acting; Manufacturer: Bourns; Order-Code: 652-SF-0603F050-2; Distributor: Mouser; Added: 02.02.2017; Price (CHF): 0.542; Mfr. Part No.: SF-0603F050-2; ComponentLink1Description: Mouser Datasheet; ComponentLink1URL: https://www.mouser.ch/datasheet/2/54/f0603f-778085.pdf; Package: 0603; Notice: -; Mounting Style: SMD/SMT
Q100 = Q-BC847BS: Bipolares Transistor-Array, Universal, NPN, 45 V, 250 mW, 100 mA, 200 hFE, SC-88; Manufacturer: Diodes Incorporated; Mfr. Part No.: BC847BS-7-F; Order-Code: 621-BC847BS-7-F; Distributor: Mouser; Price (CHF): 0.23; Added: 28.08.2018; ComponentLink1Description: DUAL NPN SMALL SIGNAL SURFACE MOUNT TRANSISTOR; ComponentLink1URL: https://www.mouser.ch/datasheet/2/115/ds30222-71055.pdf; Package: SOT-23-6; Notice: -; Mounting Style: SMD/SMT
R100-R107 = R-SMD-0603: as R200 on sheet SDCardButtonLed; Price (CHF): 0.1; Distributor: Mouser; Notice: -; Added: 10.11.2012; Mounting Style: SMD/SMT; Package: 0603
U100 = U-FT231XQ-R: USB Interface IC USB to Full Serial UART; Order-Code: 895-FT231XQ-R; PackageVersion: Feb-2012; ComponentLink2Description: Datasheet; Code_JEDEC: MO-220WGGD-1; DatasheetVersion: ver 1.0, Feb-2012; ComponentLink2URL: http://www.ftdichip.com/Support/Documents/DataSheets/ICs/DS_FT231X.pdf; ComponentLink1Description: Manufacturer URL; ComponentLink3Description: FT231X Product Page; PackageReference: QFN-20; ComponentLink3URL: www.ftdichip.com/Products/ICs/FT231X.html; ComponentLink1URL: http://www.ftdichip.com/; PackageDescription: 20-Pin Quad Flat No-Lead, 4 x 4 mm Body, 0.5 mm Pitch; Added: 10.08.2021; Distributor: Mouser; Notice: -; Package: QFN-20; Mounting Style: SMD/SMT; Mfr. Part No.: FT231XQ-R
U101 = U-ICM-40627: IMUs - Inertial Measurement Units Highly accurate MEMS based motion sensor; Manufacturer: TDK InvenSense; Order-Code: 410-ICM-40627; Mfr. Part No.: ICM-40627; Distributor: Mouser; Price (CHF): 3.58; Added: 06.08.2021; Mounting Style: SMD/SMT; Package: LGA-14; Notice: -
U103 = U-ESDA7P120-1U1M: 5V High power transient voltage suppressor; Manufacturer: STMicroelectronics; Order-Code: 511-ESDA7P120-1U1M; Distributor: Mouser; Price (CHF): 0.139; Added: 07.08.2021; Mfr. Part No.: ESDA7P120-1U1M; Package: ESD_QFN1610_2N_1K_2A; Mounting Style: SMD; Notice: -
X100 = X-MicroUSB: USB-Stecker MICRO USB B; Manufacturer: Molex; Mfr. Part No.: 105017-0001; Order-Code: 538-105017-0001; Distributor: Mouser; Price (CHF): 0.523; Value: *; Package: MicroUSB; Mounting Style: SMD/SMT; Added: 10.08.2021; Notice: *

## Nets that join several sheets
3V3: WirlessSubSystem (15 pins), SDCardButtonLed (13 pins), PowerSupply (C500.2 J10.1 U500.2 U502.5), USB_UART_IMU (13 pins)
A_Vcc: PowerSupply (J10.2), Analog_System (9 pins)
AGND: PowerSupply (J11.2), Analog_System (11 pins)
GND: WirlessSubSystem (13 pins), SDCardButtonLed (15 pins), PowerSupply (17 pins), USB_UART_IMU (26 pins)
USB_5V: PowerSupply (C501.2 C505.2 U500.8 U501.4), USB_UART_IMU (C100.2 C101.2 F100.2 U100.12)
CLK: WirlessSubSystem (U400.17), SDCardButtonLed (R212.1 X200.5)
CS: WirlessSubSystem (U400.20), SDCardButtonLed (R210.1 X200.2)
I2S_BCLK: WirlessSubSystem (U400.34), Analog_System (MK300.4 U300.16)
I2S_DIN: WirlessSubSystem (U400.39), Analog_System (U300.1)
I2S_DOUT: WirlessSubSystem (U400.42), Analog_System (MK300.6 R305.2)
I2S_LRCLK: WirlessSubSystem (U400.16), Analog_System (MK300.1 U300.14)
MISO: WirlessSubSystem (U400.22), SDCardButtonLed (R213.1 X200.7)
MOSI: WirlessSubSystem (U400.21), SDCardButtonLed (R211.1 X200.3)
NetC200_2: WirlessSubSystem (U400.9), SDCardButtonLed (C200.2 R209.1 S205.1), USB_UART_IMU (Q100.6)
NetQ100_3: WirlessSubSystem (U400.23), SDCardButtonLed (R207.1 R213.2 S204.1), USB_UART_IMU (Q100.3)
NetR106_1: WirlessSubSystem (U400.12), USB_UART_IMU (R106.1 U101.4)
NetR107_1: WirlessSubSystem (U400.13), USB_UART_IMU (R107.1 U101.9)
NetR200_1: WirlessSubSystem (U400.5), SDCardButtonLed (R200.1 S200.2)
NetR201_1: WirlessSubSystem (U400.6), SDCardButtonLed (R201.1 S201.2)
NetR202_1: WirlessSubSystem (U400.7), SDCardButtonLed (R202.1 S202.2)
NetR203_1: WirlessSubSystem (U400.8), SDCardButtonLed (R203.1 S203.2)
NetR204_2: WirlessSubSystem (U400.24), SDCardButtonLed (R204.2)
NetR205_2: WirlessSubSystem (U400.27), SDCardButtonLed (R205.2)
NetR206_2: WirlessSubSystem (U400.38), SDCardButtonLed (R206.2)
NetR208_1: WirlessSubSystem (U400.10), SDCardButtonLed (R208.1 X200.9)
NetR503_1: WirlessSubSystem (U400.11), PowerSupply (R503.1 R504.2)
RXD: WirlessSubSystem (U400.41), USB_UART_IMU (U100.1)
SCL: WirlessSubSystem (U400.14), USB_UART_IMU (R104.1 U101.13)
SDA: WirlessSubSystem (U400.15), USB_UART_IMU (R105.1 U101.14)
TXD: WirlessSubSystem (U400.40), USB_UART_IMU (U100.17)